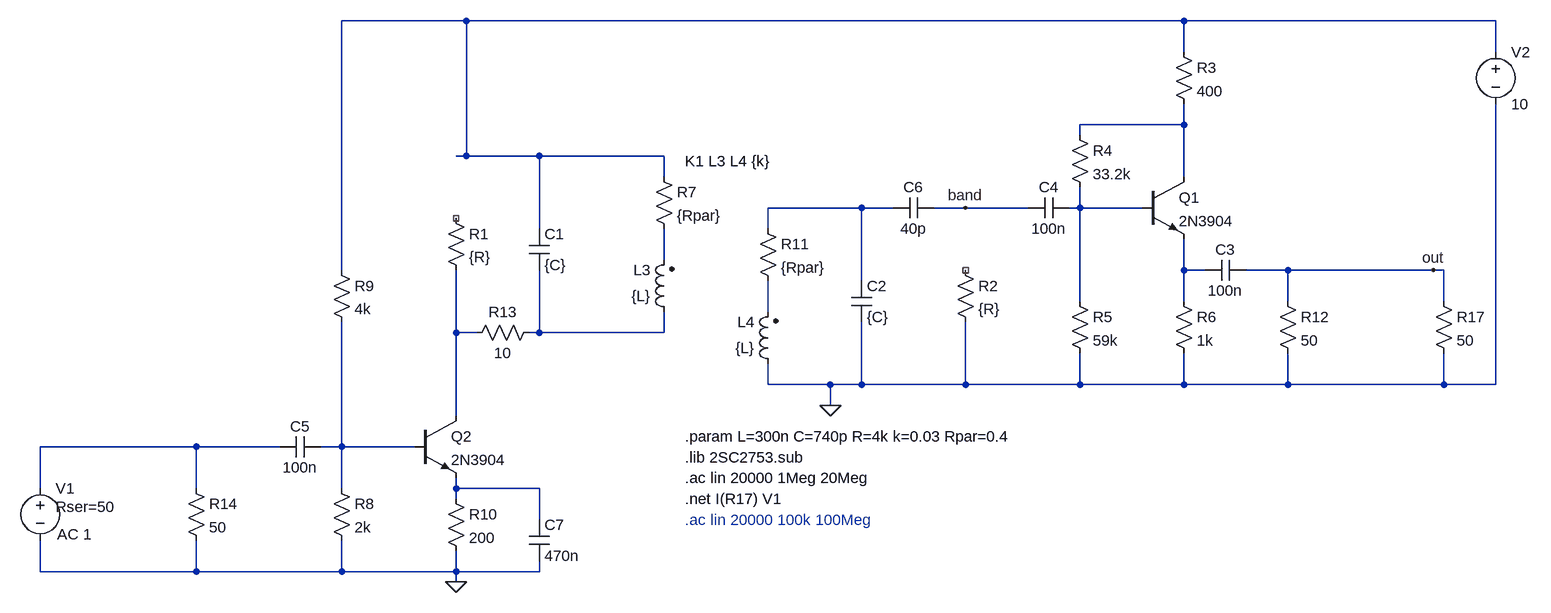
[diagram p0: schematic filter.asc]
filter.asc, the LTspice schematic file:
Version 4
SHEET 1 2536 760
WIRE 272 -176 80 -176
WIRE 1376 -176 272 -176
WIRE 1856 -176 1376 -176
WIRE 1376 -128 1376 -176
WIRE 1856 -128 1856 -176
WIRE 1376 -16 1376 -48
WIRE 1376 -16 1216 -16
WIRE 1216 0 1216 -16
WIRE 272 32 272 -176
WIRE 272 32 256 32
WIRE 384 32 272 32
WIRE 576 32 384 32
WIRE 576 64 576 32
WIRE 1376 64 1376 -16
WIRE 880 112 736 112
WIRE 928 112 880 112
WIRE 1040 112 992 112
WIRE 1136 112 1040 112
WIRE 1216 112 1216 80
WIRE 1216 112 1200 112
WIRE 1312 112 1216 112
WIRE 384 144 384 32
WIRE 736 144 736 112
WIRE 576 192 576 144
WIRE 80 208 80 -176
WIRE 1376 208 1376 160
WIRE 1408 208 1376 208
WIRE 1536 208 1472 208
WIRE 1760 208 1536 208
WIRE 1776 208 1760 208
WIRE 880 224 880 112
WIRE 1216 256 1216 112
WIRE 1376 256 1376 208
WIRE 1536 256 1536 208
WIRE 1776 256 1776 208
WIRE 736 272 736 224
WIRE 256 304 256 208
WIRE 288 304 256 304
WIRE 384 304 384 208
WIRE 384 304 368 304
WIRE 576 304 576 272
WIRE 576 304 384 304
WIRE 736 384 736 352
WIRE 832 384 736 384
WIRE 880 384 880 288
WIRE 880 384 832 384
WIRE 1040 384 1040 288
WIRE 1040 384 880 384
WIRE 1216 384 1216 336
WIRE 1216 384 1040 384
WIRE 1376 384 1376 336
WIRE 1376 384 1216 384
WIRE 1536 384 1536 336
WIRE 1536 384 1376 384
WIRE 1776 384 1776 336
WIRE 1776 384 1536 384
WIRE 1856 384 1856 -48
WIRE 1856 384 1776 384
WIRE 832 416 832 384
WIRE 256 432 256 304
WIRE -144 480 -384 480
WIRE -16 480 -144 480
WIRE 80 480 80 288
WIRE 80 480 48 480
WIRE 192 480 80 480
WIRE -384 544 -384 480
WIRE -144 544 -144 480
WIRE 80 544 80 480
WIRE 256 544 256 528
WIRE 384 544 256 544
WIRE 256 560 256 544
WIRE 384 592 384 544
WIRE -384 672 -384 624
WIRE -144 672 -144 624
WIRE -144 672 -384 672
WIRE 80 672 80 624
WIRE 80 672 -144 672
WIRE 256 672 256 640
WIRE 256 672 80 672
WIRE 384 672 384 656
WIRE 384 672 256 672
WIRE 256 688 256 672
FLAG 256 688 0
FLAG 832 416 0
FLAG 1040 112 band
FLAG 1760 208 out
SYMBOL res 240 112 R0
SYMATTR InstName R1
SYMATTR Value {R}
SYMBOL cap 368 144 R0
SYMATTR InstName C1
SYMATTR Value {C}
SYMBOL cap 864 224 R0
SYMATTR InstName C2
SYMATTR Value {C}
SYMBOL res 1024 192 R0
SYMATTR InstName R2
SYMATTR Value {R}
SYMBOL ind2 592 288 R180
WINDOW 0 36 80 Left 2
WINDOW 3 36 40 Left 2
SYMATTR InstName L3
SYMATTR Value {L}
SYMBOL ind2 752 368 R180
WINDOW 0 36 80 Left 2
WINDOW 3 36 40 Left 2
SYMATTR InstName L4
SYMATTR Value {L}
SYMBOL res 1200 -16 R0
SYMATTR InstName R4
SYMATTR Value 33.2k
SYMBOL res 1200 240 R0
SYMATTR InstName R5
SYMATTR Value 59k
SYMBOL res 1360 240 R0
SYMATTR InstName R6
SYMATTR Value 1k
SYMBOL voltage 1856 -144 R0
WINDOW 123 0 0 Left 0
WINDOW 39 0 0 Left 0
SYMATTR InstName V2
SYMATTR Value 10
SYMBOL cap 1472 192 R90
WINDOW 0 0 32 VBottom 2
WINDOW 3 32 32 VTop 2
SYMATTR InstName C3
SYMATTR Value 100n
SYMBOL res 1360 -144 R0
SYMATTR InstName R3
SYMATTR Value 400
SYMBOL res 64 528 R0
SYMATTR InstName R8
SYMATTR Value 2k
SYMBOL res 64 192 R0
SYMATTR InstName R9
SYMATTR Value 4k
SYMBOL cap 48 464 R90
WINDOW 0 0 32 VBottom 2
WINDOW 3 32 32 VTop 2
SYMATTR InstName C5
SYMATTR Value 100n
SYMBOL res 240 544 R0
SYMATTR InstName R10
SYMATTR Value 200
SYMBOL npn 192 432 R0
SYMATTR InstName Q2
SYMATTR Value 2N3904
SYMBOL cap 368 592 R0
SYMATTR InstName C7
SYMATTR Value 470n
SYMBOL res 1760 240 R0
SYMATTR InstName R17
SYMATTR Value 50
SYMBOL voltage -384 528 R0
WINDOW 123 26 87 Left 2
WINDOW 39 24 44 Left 2
SYMATTR Value2 AC 1
SYMATTR SpiceLine Rser=50
SYMATTR InstName V1
SYMATTR Value ""
SYMBOL npn 1312 64 R0
SYMATTR InstName Q1
SYMATTR Value 2N3904
SYMBOL res 560 48 R0
SYMATTR InstName R7
SYMATTR Value {Rpar}
SYMBOL res 720 128 R0
SYMATTR InstName R11
SYMATTR Value {Rpar}
SYMBOL cap 1200 96 R90
WINDOW 0 0 32 VBottom 2
WINDOW 3 32 32 VTop 2
SYMATTR InstName C4
SYMATTR Value 100n
SYMBOL res 1520 240 R0
SYMATTR InstName R12
SYMATTR Value 50
SYMBOL cap 992 96 R90
WINDOW 0 0 32 VBottom 2
WINDOW 3 32 32 VTop 2
SYMATTR InstName C6
SYMATTR Value 40p
SYMBOL res 384 288 R90
WINDOW 0 0 56 VBottom 2
WINDOW 3 32 56 VTop 2
SYMATTR InstName R13
SYMATTR Value 10
SYMBOL res -160 528 R0
SYMATTR InstName R14
SYMATTR Value 50
TEXT 608 40 Left 2 !K1 L3 L4 {k}
TEXT 608 528 Left 2 !.ac lin 20000 1Meg 20Meg
TEXT 608 496 Left 2 !.lib 2SC2753.sub
TEXT 608 464 Left 2 !.param L=300n C=740p R=4k k=0.03 Rpar=0.4
TEXT 608 560 Left 2 !.net I(R17) V1
TEXT 608 592 Left 2 ;.ac lin 20000 100k 100Meg

The netlist it stands for:
* filter.asc
R1 NC_01 N008 {R}
C1 N001 N009 {C}
C2 N003 0 {C}
R2 NC_02 0 {R}
L3 N009 N005 {L}
L4 0 N007 {L}
R4 N002 N004 33.2k
R5 N004 0 59k
R6 N006 0 1k
V2 N001 0 10
C3 out N006 100n
R3 N001 N002 400
R8 N011 0 2k
R9 N001 N011 4k
C5 N011 N010 100n
R10 N012 0 200
Q2 N008 N011 N012 0 2N3904
C7 N012 0 470n
R17 out 0 50
V1 N010 0 AC 1 Rser=50
Q1 N002 N004 N006 0 2N3904
R7 N001 N005 {Rpar}
R11 N003 N007 {Rpar}
C4 N004 band 100n
R12 out 0 50
C6 band N003 40p
R13 N009 N008 10
R14 N010 0 50
.model NPN NPN
.model PNP PNP
.lib standard.bjt
K1 L3 L4 {k}
.ac lin 20000 1Meg 20Meg
.lib 2SC2753.sub
.param L=300n C=740p R=4k k=0.03 Rpar=0.4
.net I(R17) V1
* .ac lin 20000 100k 100Meg
.backanno
.end